# EasyEDA Pro project ESP32_Wroom.eprj, schematic Schematic2
Board Name: Board2; Create Date: 2025-11-18; Page Name: P1; Project Name: ESP32_Wroom; Schematic Name: Schematic2; Update Date: 2025-12-23; Company: EasyEDA.com; Page Size: A4; Version: V1.0
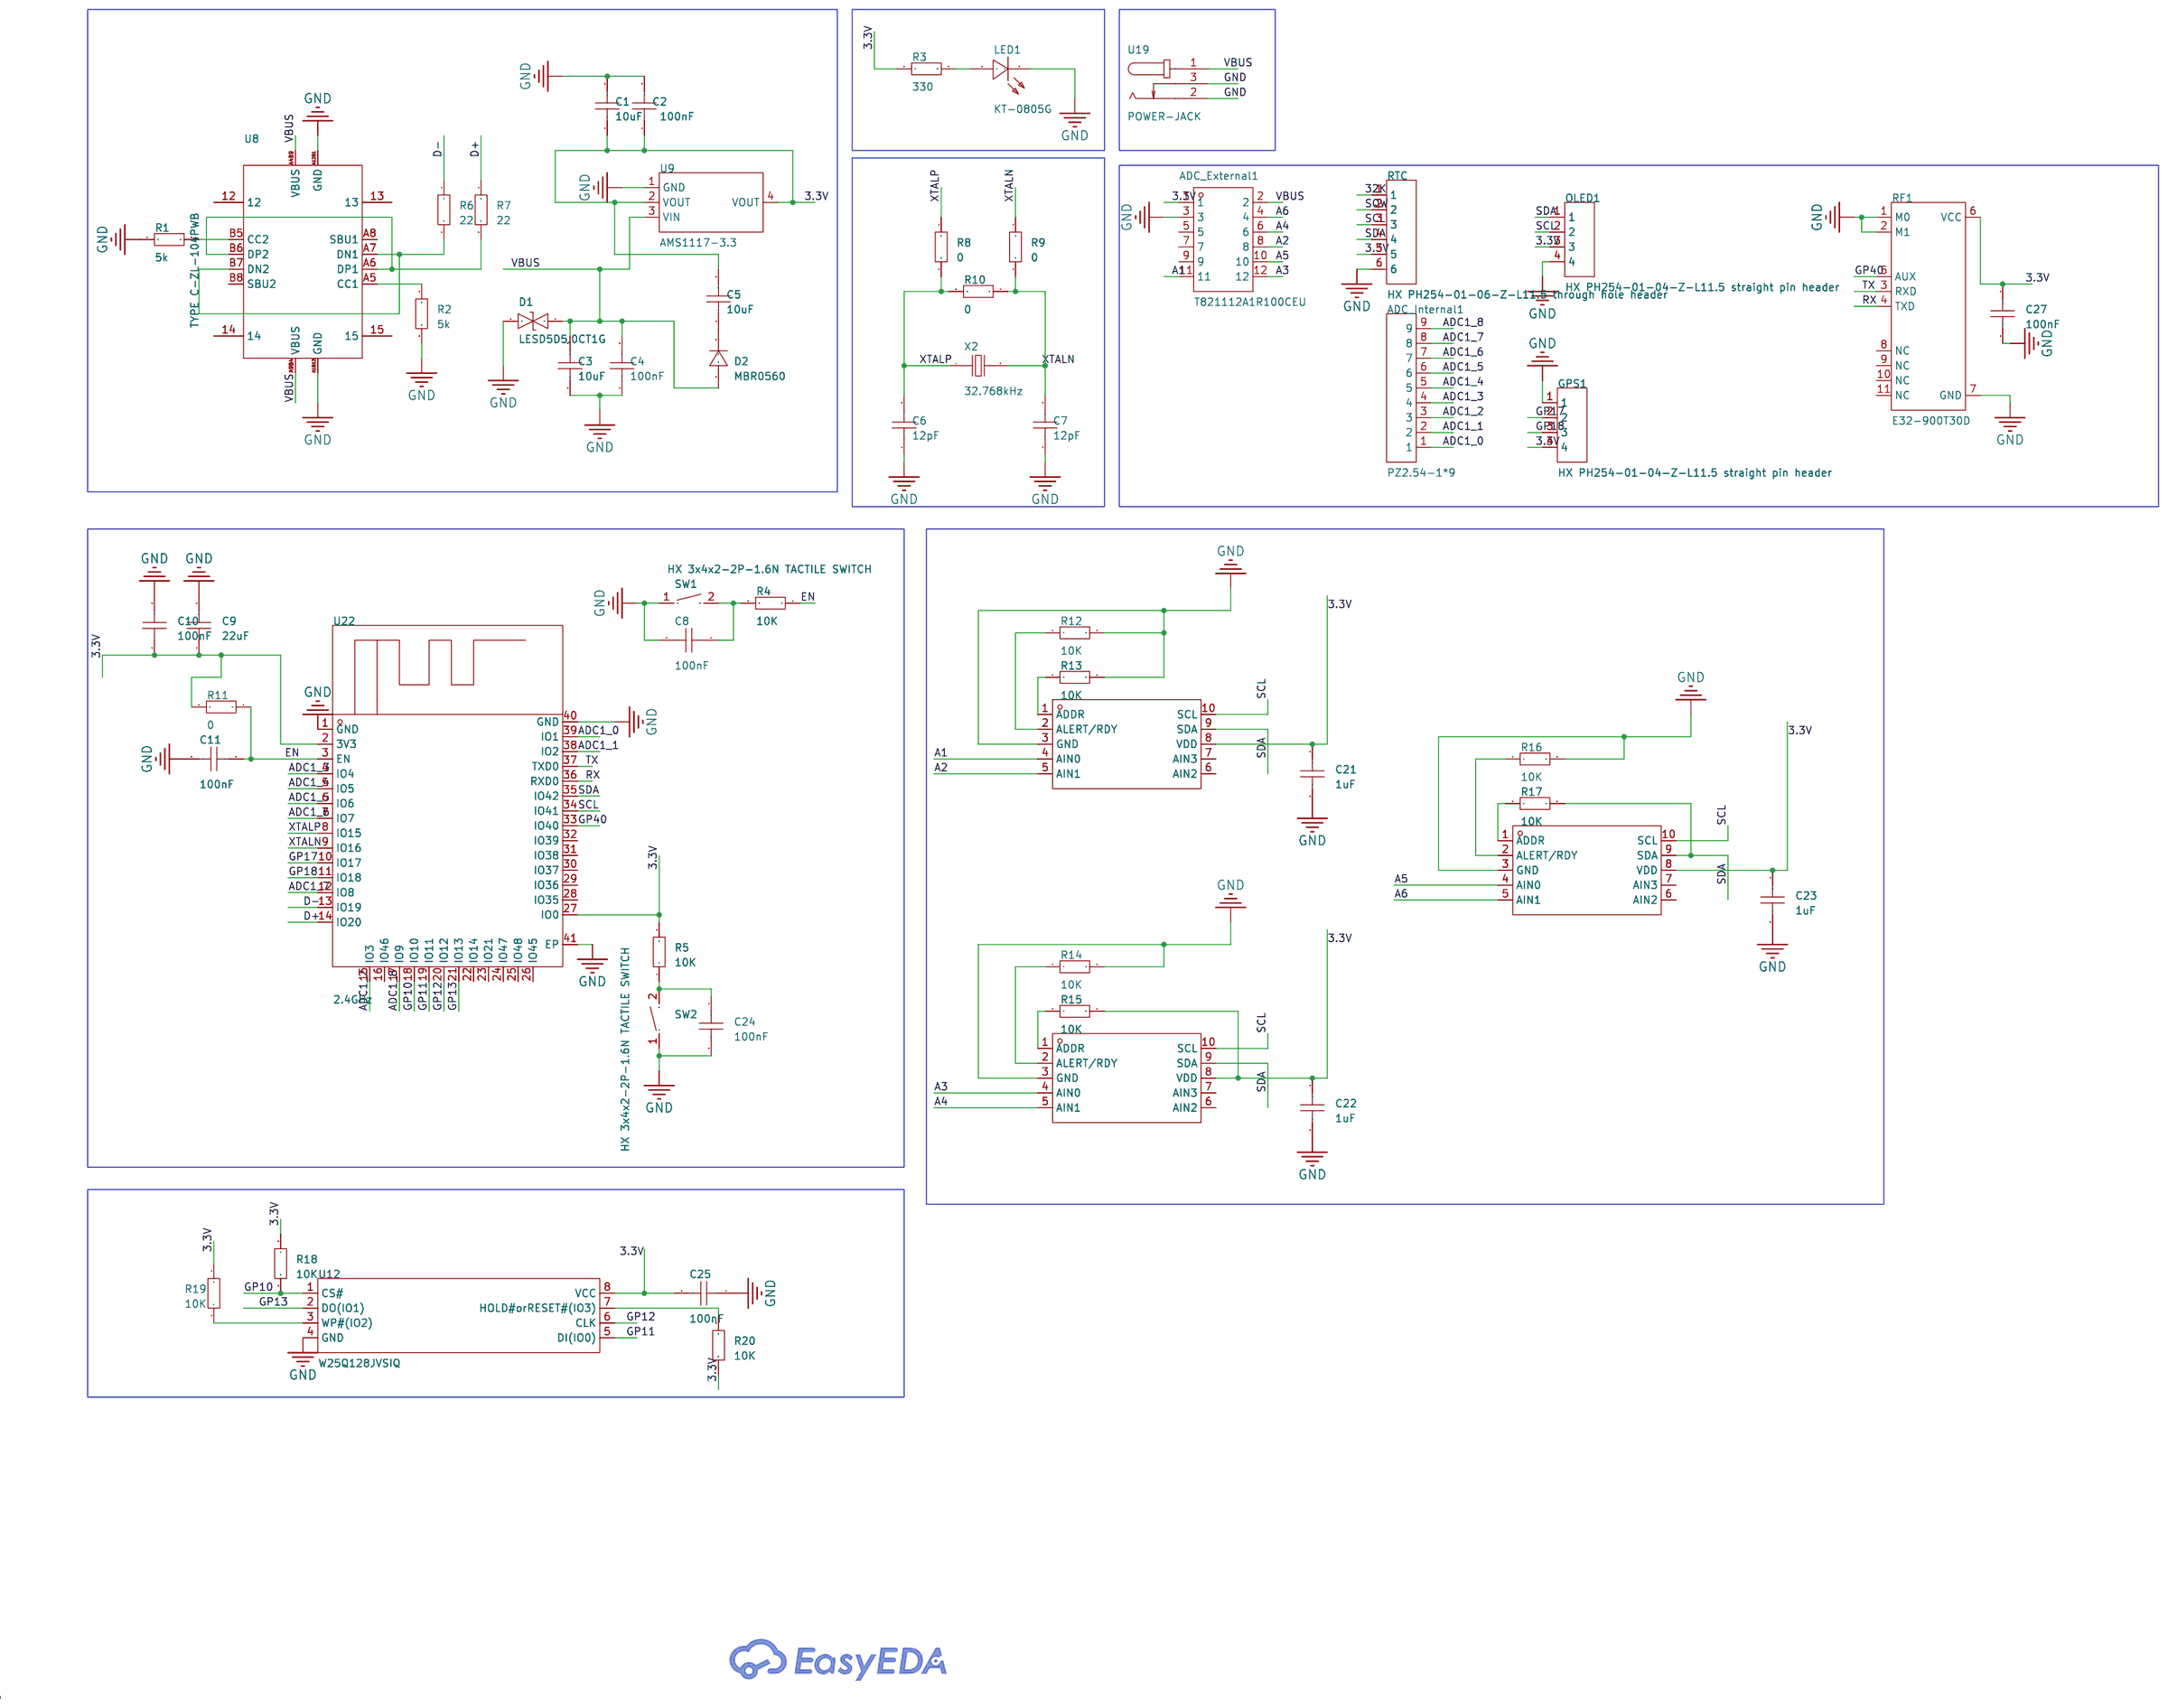
[diagram p1: schematic sheet]

## Parts
ADC_External1  T821112A1R100CEU  [IDC-TH_12P-P2.54_BOOMELE-2X6P-2.54MM]
ADC_Internal1  PZ2.54-1*9  [HDR-TH_9P-P2.54-V-M]
C1  10uF  [C0603]
C2  100nF  [C0603]
C3  10uF  [C0603]
C4  100nF  [C0603]
C5  10uF  [C0603]
C6  12pF  [C0603]
C7  12pF  [C0603]
C8  100nF  [C0603]
C9  22uF  [C0603]
C10  100nF  [C0603]
C11  100nF  [C0603]
C21  1uF  [C0603]
C22  1uF  [C0603]
C23  1uF  [C0603]
C24  100nF  [C0603]
C25  100nF  [C0603]
C27  100nF  [C0603]
D1  LESD5D5.0CT1G  [SOD-523_L1.2-W0.8-LS1.6-BI]
D2  MBR0560  [SOD-123_L2.8-W1.8-LS3.7-RD]
GPS1  HX PH254-01-04-Z-L11.5 straight pin header  [HDR-TH_4P-HX-PH254-01-04-Z-L11.5]
LED1  KT-0805G  [LED0805-R-RD]
OLED1  HX PH254-01-04-Z-L11.5 straight pin header  [HDR-TH_4P-HX-PH254-01-04-Z-L11.5]
R1  5k  [R0603]
R2  5k  [R0603]
R3  330  [R0603]
R4  10K  [R0603]
R5  10K  [R0603]
R6  22  [R0603]
R7  22  [R0603]
R8  0  [R0603]
R9  0  [R0603]
R10  0  [R0603]
R11  0  [R0603]
R12  10K  [R0603]
R13  10K  [R0603]
R14  10K  [R0603]
R15  10K  [R0603]
R16  10K  [R0603]
R17  10K  [R0603]
R18  10K  [R0603]
R19  10K  [R0603]
R20  10K  [R0603]
RF1  E32-900T30D  [WIRELM-TH_E32-900T30D]
RTC  HX PH254-01-06-Z-L11.5 through hole header  [HDR-TH_6P-P2.54-V-M]
SW1  HX 3x4x2-2P-1.6N TACTILE SWITCH  [KEY-SMD_L4.0-W3.0-LS4.9-1]
SW2  HX 3x4x2-2P-1.6N TACTILE SWITCH  [KEY-SMD_L4.0-W3.0-LS4.9-1]
U8  TYPE C-ZL-104PWB  [TYPE-C-SMD_HDGC_TYPE-C-ZL-104PWB]
U9  AMS1117-3.3  [SOT-223-3_L6.5-W3.4-P2.30-LS7.0-BR]
U12  W25Q128JVSIQ  [SOIC-8_L5.3-W5.3-P1.27-LS8.0-BL]
U18  ADS1115IDGSR  [MSOP-10_L3.0-W3.0-P0.50-LS5.0-BL]
U19  POWER-JACK  [DC-IN-TH_POWER-JACK]
U20  ADS1115IDGSR  [MSOP-10_L3.0-W3.0-P0.50-LS5.0-BL]
U21  ADS1115IDGSR  [MSOP-10_L3.0-W3.0-P0.50-LS5.0-BL]
U22  2.4GHz  [WIFIM-SMD_ESP32-S3-WROOM-1-N8]
X2  32.768kHz  [FC-135R_L3.2-W1.5]

## Library data of the parts
ADC_External1 = T821112A1R100CEU: Supplier Part: C2928696; Supplier Footprint: Header6X2; JLCPCB Part Class: Extended Part; Supplier: LCSC
ADC_Internal1 = PZ2.54-1*9: LCSC Part Name: 1x9P 间距:2.54mm 方针 直插; Supplier Part: C5360901; Manufacturer: ZHOURI(洲日); Supplier Footprint: 插件,P=2.54mm; JLCPCB Part Class: Extended Part; Datasheet: https://item.szlcsc.com/datasheet/PZ2.54-1*9/6180460.html; Supplier: LCSC; Pin Structure: 1x9P; Pitch: 2.54mm; Circluar Pins/Square Pins: Pin Header; Mounting Type: Through Hole; Number of Rows: 1; Number of Pins: 9P; Current Rating: 2.5A; Length of Mating Pin: 6mm; Insulation Height: 2.54mm; Length of End Connection Pin: 3mm; Contact Material: Brass; Contact Plating: Gold; Operating Temperature: -40℃~+105℃
C1-C11 C21-C25 C27 = CAP_0603: Supplier Footprint: 0603
D1 = LESD5D5.0CT1G: 极性:双向;反向截止电压(Vrwm):5V;击穿电压(VBR):5.6V;钳位电压(Vc)@Ipp:18.6V;; LCSC Part Name: 双向ESD; Supplier Part: C383211; Manufacturer: LRC(乐山无线电); Supplier Footprint: SOD-523; JLCPCB Part Class: ExtendedPart; Datasheet: https://atta.szlcsc.com/upload/public/pdf/source/20190807/C383211_633DF4B4E2C161403226E5235FE33A1C.pdf; Supplier: LCSC; Polarity: 双向; Reverse Stand-Off Voltage (Vrwm): 5V; Breakdown Voltage (VBR): 5.6V; Peak Pulse Current(Ipp)@8/20us: 9.4A; Clamping Voltage@Ipp: 18.6V
D2 = MBR0560_1: LCSC Part Name: 电压:60V 电流:0.5A; Supplier Part: C6077529; Manufacturer: LGE(鲁光); Supplier Footprint: SOD-123FL; JLCPCB Part Class: Extended Part; Datasheet: https://item.szlcsc.com/datasheet/MBR0560/7017746.html; Supplier: LCSC; Diode Configuration: Independent; Voltage - DC Reverse(Vr): 60V; Current - Rectified: 500mA; Operating Junction Temperature Range: -55℃~+175℃; Non-Repetitive Peak Forward Surge Current: 15A
GPS1 OLED1 = HX PH254-01-04-Z-L11.5 straight pin header: LCSC Part Name: 1x4P 间距:2.54mm 方针 直插; Supplier Part: C52016392; Manufacturer: hanxia(韩下); Supplier Footprint: 插件,P=2.54mm; JLCPCB Part Class: Extended Part; Datasheet: https://item.szlcsc.com/datasheet/HX%2520PH254-01-04-Z-L11.5%2520straight%2520pin%2520header/54760437.html; Supplier: LCSC; Pin Structure: 1x4P; Pitch: 2.54mm; Circluar Pins/Square Pins: Pin Header; Mounting Type: Through Hole; Number of Rows: 1; Number of Pins: 4P; Current Rating: 3A; Voltage Rating (Max): 1kV; Length of Mating Pin: 6mm; Insulation Height: 2.5mm; Length of End Connection Pin: 3mm; Contact Material: Brass; Contact Plating: Gold; Operating Temperature: -40℃~+105℃
LED1 = KT-0805G: LCSC Part Name: 0805 翠绿 高亮; Supplier Part: C2297; Manufacturer: KENTO; Supplier Footprint: 0805; JLCPCB Part Class: Basic Part; Datasheet: https://item.szlcsc.com/datasheet/KT-0805G/2670.html; Supplier: LCSC; Illumination Color: Emerald Green; Voltage - Forward(Vf): 2.6V~3.1V; Power(Watts): 100mW; Forward Current: 5mA; Wavelength - Dominant: 513nm~528nm; Peak Wavelength: 525nm; Luminous Intensity: 430mcd; Viewing Angle: 120°; Operating Temperature: -40℃~+85℃
R1 R2 R6 R7 = Res_0603: Supplier Footprint: 0603
R3-R5 R8-R20 = 0603WAF1503T5E: LCSC Part Name: 150kΩ ±1% 100mW 厚膜电阻; Supplier Part: C22807; Manufacturer: UNI-ROYAL(厚声); Supplier Footprint: 0603; JLCPCB Part Class: Basic Part; Datasheet: https://item.szlcsc.com/datasheet/0603WAF1503T5E/23534.html; Supplier: LCSC; Type: Thick Film Resistors; Tolerance: ±1%; Power(Watts): 0.1W; Voltage-Supply(Max): 75V; Temperature Coefficient: ±100ppm/℃; Operating Temperature: -55℃~+155℃
RF1 = E32-900T30D: Supplier Part: C9900133952; Supplier Footprint: 插件; Supplier: LCSC
RTC = HX PH254-01-06-Z-L11.5 through hole header: LCSC Part Name: 1x6P 间距:2.54mm 方针 直插; Supplier Part: C52016393; Manufacturer: hanxia(韩下); Supplier Footprint: 插件,P=2.54mm; JLCPCB Part Class: Extended Part; Datasheet: https://item.szlcsc.com/datasheet/HX%2520PH254-01-06-Z-L11.5%2520through%2520hole%2520header/54760438.html; Supplier: LCSC; Pin Structure: 1x6P; Pitch: 2.54mm; Circluar Pins/Square Pins: Pin Header; Mounting Type: Through Hole; Number of Rows: 1; Number of Pins: 6P; Current Rating: 3A; Voltage Rating (Max): 1kV; Length of Mating Pin: 6mm; Insulation Height: 2.5mm; Length of End Connection Pin: 3mm; Contact Material: Brass; Contact Plating: Gold; Operating Temperature: -40℃~+105℃
SW1 SW2 = HX 3x4x2-2P-1.6N TACTILE SWITCH: LCSC Part Name: 4*3*2mm 立贴 轻触开关; Supplier Part: C49234124; Manufacturer: hanxia(韩下); Supplier Footprint: SMD; JLCPCB Part Class: Extended Part; Datasheet: https://item.szlcsc.com/datasheet/HX%25203x4x2-2P-1.6N%2520TACTILE%2520SWITCH/51650185.html; Supplier: LCSC; Circuit: SPST; Actuator Style: Round Button; Operating Force: 1.6N; Mounting Type: Surface Mount,Vertical; Length: 4mm; Width: 3mm; Switch Height: 2mm; with Bracket: Without Bracket; Contact Current: 50mA; Voltage Rating: 12V; Actuator/Cap Color: Black; With Lamp: No; Termination Style: SMD(SMT) Tab; Life: 100,000 Cycles
U8 = TYPE C-ZL-104PWB: LCSC Part Name: Type-C; Supplier Part: C5273952; Manufacturer: HDGC(华德共创); Supplier Footprint: SMD; JLCPCB Part Class: Extended Part; Datasheet: https://item.szlcsc.com/datasheet/TYPE%2520C-ZL-104PWB/6003803.html; Supplier: LCSC; Connector Type: Type-C; Number of Contacts: 16P
U9 = AMS1117-3.3_C6186: LCSC Part Name: 输出3.3V 1A; Supplier Part: C6186; Manufacturer: AMS; Supplier Footprint: SOT-223; JLCPCB Part Class: Basic Part; Datasheet: https://item.szlcsc.com/datasheet/AMS1117-3.3/6652.html; Supplier: LCSC; Output Type: Fixed; Voltage - Supply: 16V; Output Voltage: 3.3V; Output Current: 1A; Power Supply Rejection Ratio (PSRR): 72dB@(120Hz); Voltage Dropout: 1.1V@(800mA); standby current: 5mA; Noise: 0.003%Vout; Features: Over Current Protection；Over Temperature Protection; Operating Temperature: -40℃~+125℃; Output Configuration: Positive; Number of Outputs: 1
U12 = W25Q128JVSIQ_C113767: Interface:SPI Memory Size:- Clock Frequency:133MHz Voltage - Supply:2.7V~3.6V Voltage - Supply:2.7V~3.6V Program / Erase Cycles:100,000 Cycles Page Programming Time (Tpp):3ms Operating Temperature:- Operating Temperature:-; Supplier Part: C113767; Manufacturer: Winbond(华邦); Supplier Footprint: SOIC-8-208mil; JLCPCB Part Class: Extended Part; Datasheet: https://atta.szlcsc.com/upload/public/pdf/source/20180329/C113767_097B64D788F6E3FFB2E9CB46CB6C1427.pdf; Supplier: LCSC; Interface: SPI; Clock Frequency: 133MHz; Voltage - Supply: 2.7V~3.6V; Program / Erase Cycles: 100,000 Cycles; Page Programming Time (Tpp): 3ms
U18 U20 U21 = ADS1115IDGSR: Resolution(Bits):16Bit Sampling Rate:- number of channels:4 Voltage - Supply:2V~5.5V Voltage - Supply:2V~5.5V Interface:I2C differential input:- Integral non - linearity:1LSB Integral non - linearity:1LSB Operating Temperature:-40℃~+125℃ Operating Tempera; LCSC Part Name: 具有内部基准、振荡器和可编程比较器且兼容 I2C 的ADS111x、超小型、低功耗 860SPS、16位ADC; Supplier Part: C37593; Manufacturer: TI(德州仪器); Supplier Footprint: VSSOP-10; JLCPCB Part Class: Extended Part; Datasheet: https://www.ti.com/cn/lit/gpn/ads1115; Supplier: LCSC; Resolution(Bits): 16Bit; number of channels: 4; Voltage - Supply: 2V~5.5V; Interface: I2C; Integral non - linearity: 1LSB; Operating Temperature: -40℃~+125℃
U19 = POWER-JACK: Supplier Part: C9900001795; JLCPCB Part Class: Extended Part; Supplier: LCSC
U22 = ESP32-S3-WROOM-1-N8: LCSC Part Name: 通用型Wi-Fi+低功耗蓝牙MCU模组; Supplier Part: C2913198; Manufacturer: ESPRESSIF(乐鑫); Supplier Footprint: SMD,18x25.5mm; JLCPCB Part Class: Extended Part; Datasheet: https://atta.szlcsc.com/upload/public/pdf/source/20221026/9A44C6421221D672346AAE72DF9F8146.pdf; Supplier: LCSC; Core Processor: ESP32-S3 Chip; Support Interface: I2C；GPIO；SPI；PWM；ADC；UART；USB；I2S
X2 = Q13FC13500004_C32346: LCSC Part Name: 32.768kHz ±20ppm 12.5pF; Supplier Part: C32346; Manufacturer: EPSON(爱普生); Manufacturer Part: Q13FC13500004; Supplier Footprint: SMD3215-2P; JLCPCB Part Class: Basic Part; Datasheet: https://atta.szlcsc.com/upload/public/pdf/source/20240418/0E0FF5F0356BA3753F616001439D1416.pdf; Supplier: LCSC; Crystal Type: Surface Mount Crystal; Normal temperature Frequency Tolerance: ±20ppm; Equivalent Series Resistance (ESR): 70kΩ

## Nets
3.3V: ADC_External1.1 C1.1 C2.1 C5.2 C9.1 C10.1 C21.1 C22.1 C23.1 C25.2 C27.1 GPS1.4 OLED1.3 R3.1 R5.2 R11.2 R15.2 R18.1 R19.1 R20.2 RF1.6(VCC) RTC.5 U9.2(VOUT) U9.4(VOUT) U12.8(VCC) U18.8(VDD) U20.8(VDD) U21.8(VDD) U22.2(3V3) U22.27(IO0)
GND: ADC_External1.3 C1.2 C2.2 C3.1 C4.1 C6.1 C7.1 C8.2 C9.2 C10.2 C11.2 C21.2 C22.2 C23.2 C24.2 C25.1 C27.2 D1.2 GPS1.1 LED1.2(K) OLED1.4 R1.1 R2.2 R12.2 R13.2 R14.2 R16.2 RF1.1(M0) RF1.2(M1) RF1.7(GND) RTC.6 SW1.1 SW2.1 U8.A1B12(GND) U8.A12B1(GND) U9.1(GND) U12.4(GND) U18.3(GND) U19.2 U19.3 U20.3(GND) U21.3(GND) U22.1(GND) U22.40(GND) U22.41(EP)
VBUS: ADC_External1.2 C3.2 C4.2 D1.1 D2.2 U8.A4B9(VBUS) U8.A9B4(VBUS) U9.3(VIN) U19.1
32K: RTC.1
A1: ADC_External1.11 U18.4(AIN0)
A2: ADC_External1.8 U18.5(AIN1)
A3: ADC_External1.12 U20.4(AIN0)
A4: ADC_External1.6 U20.5(AIN1)
A5: ADC_External1.10 U21.4(AIN0)
A6: ADC_External1.4 U21.5(AIN1)
ADC1_0: ADC_Internal1.1 U22.39(IO1)
ADC1_1: ADC_Internal1.2 U22.38(IO2)
ADC1_2: ADC_Internal1.3 U22.15(IO3)
ADC1_3: ADC_Internal1.4 U22.4(IO4)
ADC1_4: ADC_Internal1.5 U22.5(IO5)
ADC1_5: ADC_Internal1.6 U22.6(IO6)
ADC1_6: ADC_Internal1.7 U22.7(IO7)
ADC1_7: ADC_Internal1.8 U22.12(IO8)
ADC1_8: ADC_Internal1.9 U22.17(IO9)
D+: R7.1 U22.14(IO20)
D-: R6.1 U22.13(IO19)
EN: C11.1 R4.1 R11.1 U22.3(EN)
GP10: R18.2 U12.1(CS#) U22.18(IO10)
GP11: U12.5(DI(IO0)) U22.19(IO11)
GP12: U12.6(CLK) U22.20(IO12)
GP13: U12.2(DO(IO1)) U22.21(IO13)
GP17: GPS1.2 U22.10(IO17)
GP18: GPS1.3 U22.11(IO18)
GP40: RF1.5(AUX) U22.33(IO40)
RX: RF1.4(TXD) U22.36(RXD0)
SCL: OLED1.2 RTC.3 U18.10(SCL) U20.10(SCL) U21.10(SCL) U22.34(IO41)
SDA: OLED1.1 R17.2 RTC.4 U18.9(SDA) U20.9(SDA) U21.9(SDA) U22.35(IO42)
SQW: RTC.2
TX: RF1.3(RXD) U22.37(TXD0)
XTALN: C7.2 R9.1 R9.2 R10.1 U22.9(IO16) X2.2
XTALP: C6.2 R8.1 R8.2 R10.2 U22.8(IO15) X2.1
$1N2640: R7.2 U8.A6(DP1) U8.B6(DP2)
$1N2644: R1.2 U8.B5(CC2)
$1N2650: R6.2 U8.A7(DN1) U8.B7(DN2)
$1N2651: R2.1 U8.A5(CC1)
$1N2657: C5.1 D2.1
$1N2661: LED1.1(A) R3.2
$1N2669: C8.1 R4.2 SW1.2
$1N2671: C24.1 R5.1 SW2.2
$1N2698: R13.1 U18.1(ADDR)
$1N2699: R12.1 U18.2(ALERT/RDY)
$1N2730: R15.1 U20.1(ADDR)
$1N2731: R14.1 U20.2(ALERT/RDY)
$1N2744: R17.1 U21.1(ADDR)
$1N2745: R16.1 U21.2(ALERT/RDY)
$1N2809: R19.2 U12.3(WP#(IO2))
$1N2816: R20.1 U12.7(HOLD#orRESET#(IO3))

Not connected (* = marked no-connect by the designer): ADC_External1 5 7 9; RF1 8(NC) 9(NC) 10(NC) 11(NC); U8 12 13 14 15 A8(SBU1) B8(SBU2); U18 6(AIN2) 7(AIN3); U20 6(AIN2) 7(AIN3); U21 6(AIN2) 7(AIN3); U22 16(IO46) 22(IO14) 23(IO21) 24(IO47) 25(IO48) 26(IO45) 28(IO35) 29(IO36) 30(IO37) 31(IO38) 32(IO39)
